# EAGLE design orientatiedag (EAGLE 9.6.2)
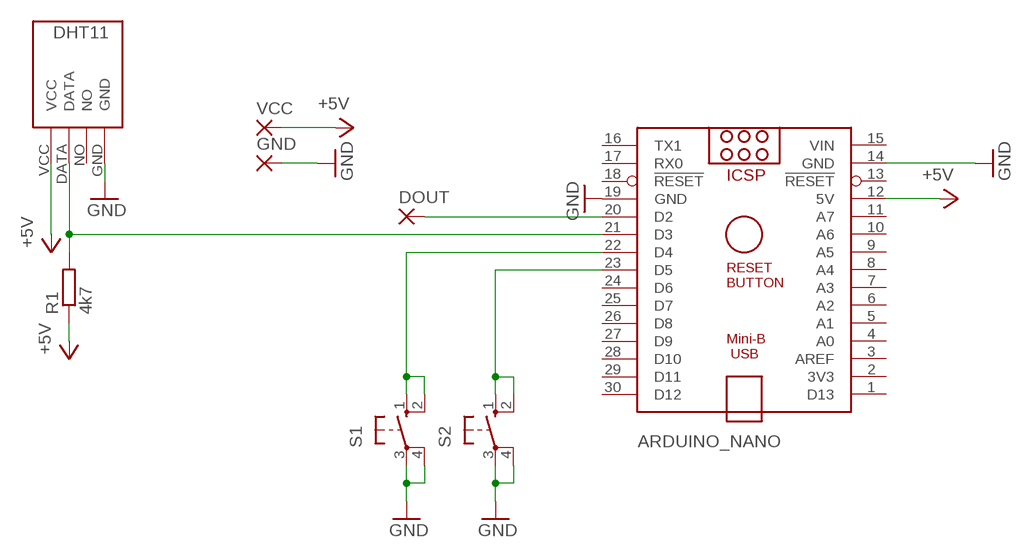
[diagram p0: schematic, sheet 1]

## Parts
ARDUINO_NANO  ARDUINO_NANO  [ARDUINO_NANO]
DOUT  2,15/1,0  [2,15/1,0]
GND  2,15/1,0  [2,15/1,0]
R1  4k7  R-EU_0207/7  [0207/7]
S1  10-XX  [B3F-10XX]
S2  10-XX  [B3F-10XX]
U$1  DHT11-PION.  [DHT11-PION.]
VCC  2,15/1,0  [2,15/1,0]

## Nets
+5V: ARDUINO_NANO.12(5V) R1.1 U$1.VCC VCC.1(P)
DHT-DATA: ARDUINO_NANO.21(D3) R1.2 U$1.DATA
GND: ARDUINO_NANO.14(GND) ARDUINO_NANO.19(GND) GND.1(P) S1.3(P) S1.4(P1) S2.3(P) S2.4(P1) U$1.GND
N$1: ARDUINO_NANO.22(D4) S1.1(S) S1.2(S1)
N$2: ARDUINO_NANO.23(D5) S2.1(S) S2.2(S1)
N$3: ARDUINO_NANO.20(D2) DOUT.1(P)
Unconnected: ARDUINO_NANO.1(D13) ARDUINO_NANO.2(3V3) ARDUINO_NANO.3(AREF) ARDUINO_NANO.4(A0) ARDUINO_NANO.5(A1) ARDUINO_NANO.6(A2) ARDUINO_NANO.7(A3) ARDUINO_NANO.8(A4) ARDUINO_NANO.9(A5) ARDUINO_NANO.10(A6) ARDUINO_NANO.11(A7) ARDUINO_NANO.13(!RESET) ARDUINO_NANO.16(TX1) ARDUINO_NANO.17(RX0) ARDUINO_NANO.18(!RESET) ARDUINO_NANO.24(D6) ARDUINO_NANO.25(D7) ARDUINO_NANO.26(D8) ARDUINO_NANO.27(D9) ARDUINO_NANO.28(D10) ARDUINO_NANO.29(D11) ARDUINO_NANO.30(D12) U$1.NO

## Power pins joined to a net without a drawn wire
VIN: ARDUINO_NANO.15(VIN)

## Library data of the parts
ARDUINO_NANO = ArduinoNanoV30:ARDUINO_NANO: Arduino Nano V3.0 Overview: The Arduino Nano is a small, complete, and breadboard-friendly board based on the ATmega328 (Arduino Nano 3.x) or ATmega168 (Arduino Nano 2.x). It has more or less the same functionality of the Arduino Duemilanove, but in a different package. It lacks only a DC power jack, and works with a Mini-B USB cable instead of a standard one. The Nano was designed and is being produced by Gravitech. Specifications: Microcontroller Atmel ATmega168 or ATmega328 Operating Voltage (logic level) 5 V Input Voltage (recommended) 7-12 V Input Voltage (limits) 6-20 V Digital I/O Pins 14 (of which 6 provide PWM output) Analog Input Pins 8 DC Current per I/O Pin 40 mA Flash Memory 16 KB (ATmega168) or 32 KB (ATmega328) of which 2 KB used by bootloader SRAM 1 KB (ATmega168) or 2 KB (ATmega328) EEPROM 512 bytes (ATmega168) or 1 KB (ATmega328) Clock Speed 16 MHz Dimensions 0.73" x 1.70" Length 45 mm Width 18 mm Weigth 5 g Power: The Arduino Nano can be powered via the Mini-B USB connection, 6-20V unregulated external power supply (pin 30), or 5V regulated external power supply (pin 27). The power source is automatically selected to the highest voltage source. Memory: The ATmega168 has 16 KB of flash memory for storing code (of which 2 KB is used for the bootloader); the ATmega328 has 32 KB, (also with 2 KB used for the bootloader). The ATmega168 has 1 KB of SRAM and 512 bytes of EEPROM (which can be read and written with the EEPROM library); the ATmega328 has 2 KB of SRAM and 1 KB of EEPROM. Input and Output: Each of the 14 digital pins on the Nano can be used as an input or output, using pinMode(), digitalWrite(), and digitalRead() functions. They operate at 5 volts. Each pin can provide or receive a maximum of 40 mA and has an internal pull-up resistor (disconnected by default) of 20-50 kOhms. In addition, some pins have specialized functions. Visit Arduino - ArduinoBoardNano <https://www.arduino.cc/en/Main/ArduinoBoardNano>
DOUT GND VCC = wirepad:2,15/1,0: THROUGH-HOLE PAD
R1 = rcl:R-EU_: RESISTOR, European symbol; SPICEPREFIX: R
S1 S2 = switch-omron:10-XX: OMRON SWITCH; MPN: B3F-1000; OC_FARNELL: 176432; OC_NEWARK: 36M3542
U$1 = DHT11:DHT11-PION.: DHT11 Czujnik temperatury i wilgotności (widok pionowy)

## Board
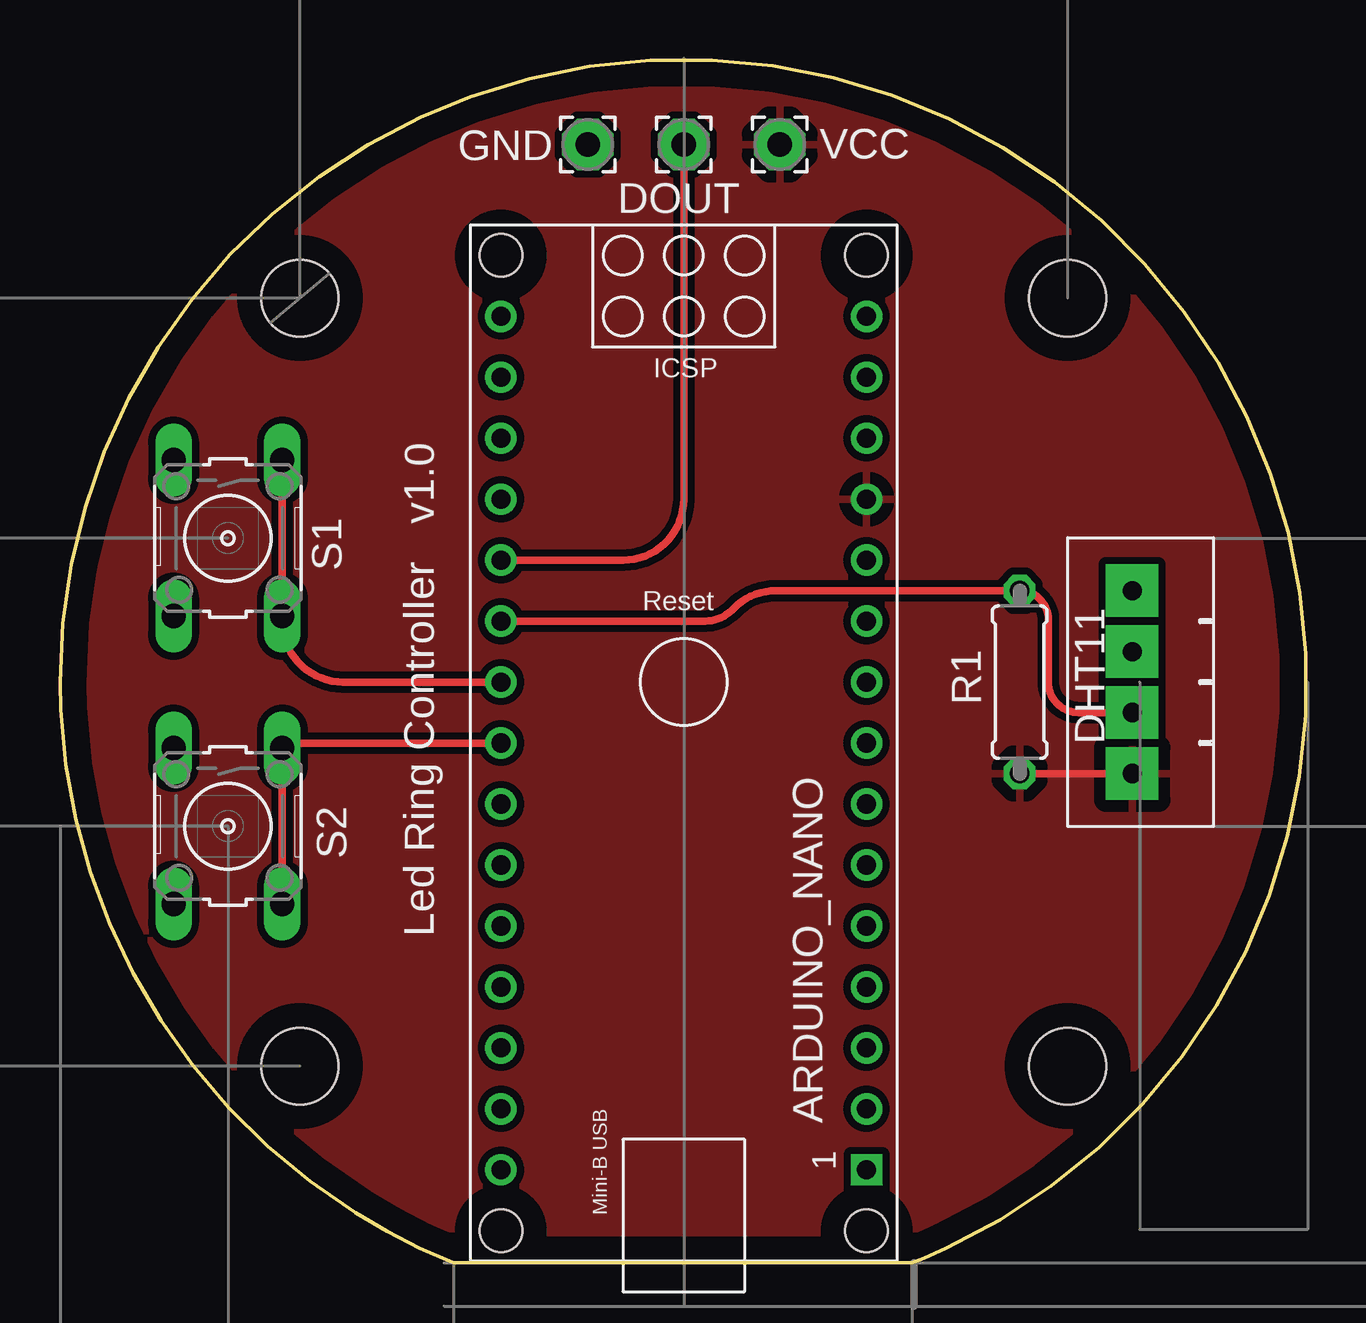
[diagram p1: board, top side]
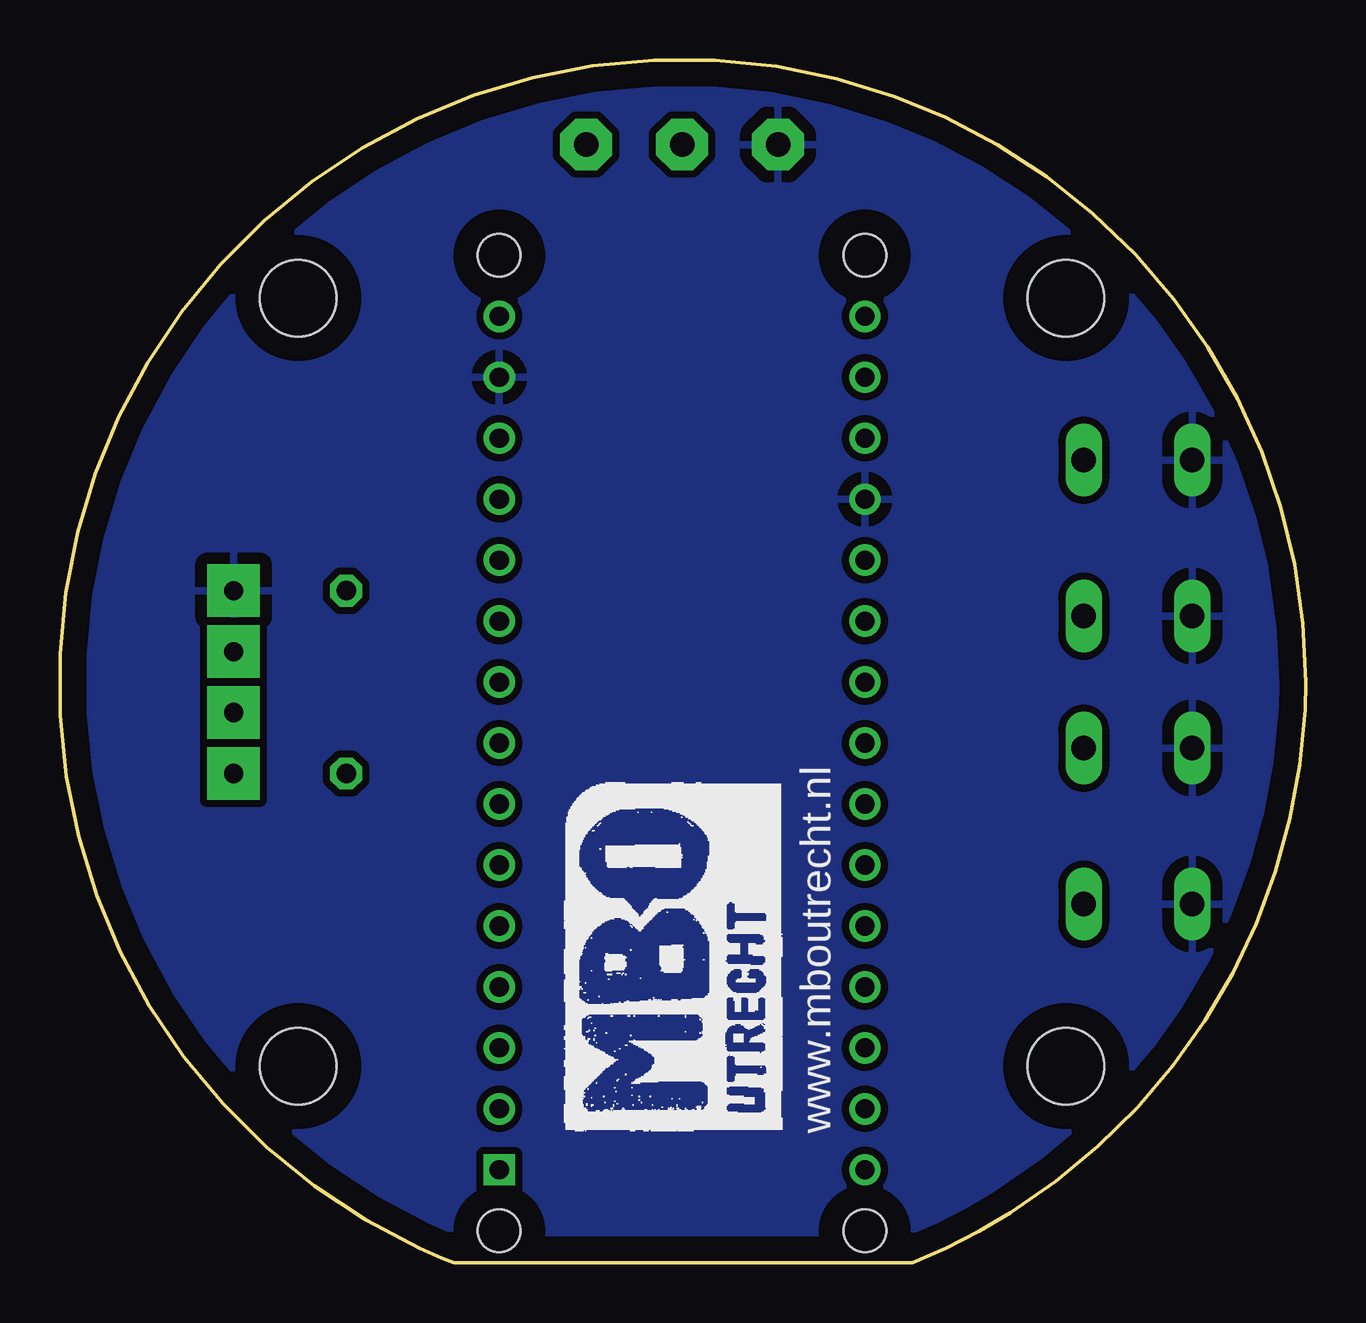
[diagram p2: board, bottom side, seen from below]

Size 51.93 x 50.12 mm. Coordinates in mm from the lower left corner, seen from the top.
Outline: 15.03,47.73 arc65 0,24.2 0.03,23.05 0.25,20.76 0.66,18.5 arc40 10.43,3.39 12.32,2.09 arc10 16.4,0 35.5,0 36,0.2 36.93,0.61 arc175 17.12,48.59 15.03,47.73
Copper layers (1*16): Top 0.035mm / dielectric 1.5mm / Bottom 0.035mm
Design rules "default *": minimum track width 6mil, minimum drill 0.35mm, track to track 6mil, track to pad 6mil, pad to pad 6mil, via to via 6mil, smd to smd 6mil, copper to edge 40mil, drill to drill 6mil, minimum pad ring 10mil, minimum via ring 8mil, stop-mask expansion 4mil, vias tented up to drill 0mil, thermal gap 0.5mm
Holes 3.2 mm at 10,8.2 10,40.2 42,40.2 42,8.2
Holes 1.78 mm at 18.38,1.34 18.38,41.98 33.62,41.98 33.62,1.34

### Footprints (pad centres in the part's own frame; a part is rotated, then mirrored left to right if it is on the bottom)
ARDUINO_NANO = drill 0.8 square: 1 -20.32,-7.62 | drill 0.8: 2 -17.78,-7.62; 3 -15.24,-7.62; 4 -12.7,-7.62; 5 -10.16,-7.62; 6 -7.62,-7.62; 7 -5.08,-7.62; 8 -2.54,-7.62; 9 0,-7.62; 10 2.54,-7.62; 11 5.08,-7.62; 12 7.62,-7.62; 13 10.16,-7.62; 14 12.7,-7.62; 15 15.24,-7.62; 16 15.24,7.62; 17 12.7,7.62; 18 10.16,7.62; 19 7.62,7.62; 20 5.08,7.62; 21 2.54,7.62; 22 0,7.62; 23 -2.54,7.62; 24 -5.08,7.62; 25 -7.62,7.62; 26 -10.16,7.62; 27 -12.7,7.62; 28 -15.24,7.62; 29 -17.78,7.62; 30 -20.32,7.62 | hole 1.778: -22.86,-7.62; -22.86,7.62; 17.78,7.62; 17.78,-7.62
2,15/1,0 = drill 1.016 pad 2.159 octagon: 1 0,0
0207/7 = drill 0.813 octagon: 1 -3.81,0; 2 3.81,0
B3F-10XX = drill 1.016 long: 1 -3.251,2.261; 2 3.251,2.261; 3 -3.251,-2.261; 4 3.251,-2.261
DHT11-PION. = drill 0.8 pad 2.184 square: DATA -1.27,0.305; GND 3.81,0.305; NO 1.27,0.305; VCC -3.81,0.305

### Placement (x,y rotation side)
ARDUINO_NANO  26,24.2 90 top
DOUT  26,46.6 0 top
GND  22,46.6 0 top
R1  40,24.2 90 top
S1  7,30.2 270 top
S2  7,18.2 270 top
U$1  45,24.2 90 top
VCC  30,46.6 0 top

### Tracks (layer width: path | path; a pad name or v marks a point on that pad's centre or on a via)
+5V
  Top 0.305: U$1.VCC R1.1
  pour Top (isolate 0.3): -1,24.2 arc-90 26,51.2 arc-90 53,24.2 arc-90 26,-2.8 arc-90
DHT-DATA
  Top 0.305: ARDUINO_NANO.21 26.89,26.74 arc45 28,27.2 28.07,27.27 arc-45 29.86,28.01 R1.2 arc-90 41.2,26.81 41.2,24.2 arc90 42.47,22.93 U$1.DATA
GND
  pour Bottom (isolate 0.3): -2,24.2 arc90 26,-3.8 arc90 54,24.2 arc90 26,52.2 arc90
N$1
  Top 0.305: S1.1 S1.2 9.26,26.74 arc90 11.8,24.2 ARDUINO_NANO.22
N$2
  Top 0.305: S2.2 S2.1 arc-90 9.47,21.66 ARDUINO_NANO.23
N$3
  Top 0.305: ARDUINO_NANO.20 23.46,29.28 arc90 26,31.82 DOUT.1

### Text on the board
tNames: v1.0 | Led Ring Controller
bNames: www.mboutrecht.nl